# Altium schematic sheet SDRAM.SchDoc
size A3; SheetNumber: 4; SheetTotal: 7
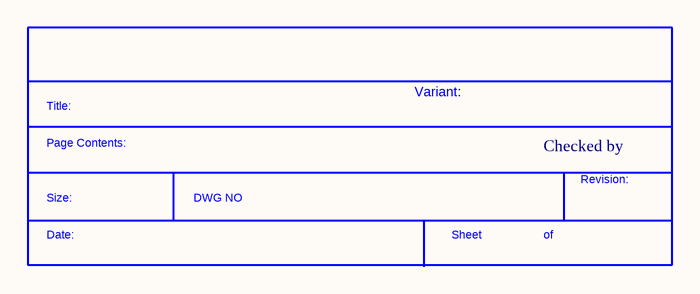
[diagram p0: SDRAM.SchDoc]

## Parts
*?  SDTitleBlock  (value not drawn)  (graphical)

## Notes on the sheet
- Variant:
- Checked by
- (in symbol SDTitleBlock) Title:; Page Contents:; Revision:; Size:; DWG NO; Date:; Sheet; of